# EAGLE design Battery Monitor (EAGLE 5.07)
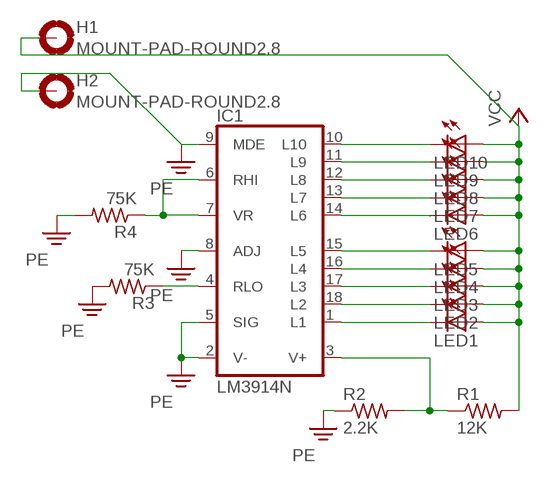
[diagram p0: schematic, sheet 1]

## Parts
H1  MOUNT-PAD-ROUND2.8  [2,8-PAD]
H2  MOUNT-PAD-ROUND2.8  [2,8-PAD]
IC1  LM3914N  [DIL18]
LED1  LEDSMT1206  [1206]
LED2  LEDSMT1206  [1206]
LED3  LEDSMT1206  [1206]
LED4  LEDSMT1206  [1206]
LED5  LEDSMT1206  [1206]
LED6  LEDSMT1206  [1206]
LED7  LEDSMT1206  [1206]
LED8  LEDSMT1206  [1206]
LED9  LEDSMT1206  [1206]
LED10  LEDSMT1206  [1206]
R1  12K  R-US_R0805  [R0805]
R2  2.2K  R-US_R0805  [R0805]
R3  75K  R-US_R0805  [R0805]
R4  75K  R-US_R0805  [R0805]

## Nets
N$1: IC1.3(V+) R1.1 R2.2
N$2: IC1.10(L10) LED10.C
N$3: IC1.11(L9) LED9.C
N$4: IC1.12(L8) LED8.C
N$5: IC1.13(L7) LED7.C
N$7: IC1.14(L6) LED6.C
N$8: IC1.15(L5) LED5.C
N$9: IC1.16(L4) LED4.C
N$10: IC1.17(L3) LED3.C
N$11: IC1.18(L2) LED2.C
N$12: IC1.1(L1) LED1.C
N$14: IC1.4(RLO) R3.1
N$15: IC1.6(RHI) IC1.7(VR) R4.1
PE: H2.B2,8(MOUNT) IC1.2(V-) IC1.5(SIG) IC1.8(ADJ) IC1.9(MDE) R2.1 R3.2 R4.2
VCC: H1.B2,8(MOUNT) LED1.A LED2.A LED3.A LED4.A LED5.A LED6.A LED7.A LED8.A LED9.A LED10.A R1.2

## Library data of the parts
H1 H2 = holes:MOUNT-PAD-ROUND: MOUNTING PAD, round
IC1 = linear:LM3914N: LED DRIVER senses analog voltage levels and drives 10 LEDs
LED1-LED10 = led:LED: LED OSRAM: - CHIPLED LG R971, LG N971, LY N971, LG Q971, LY Q971, LO R971, LY R971 LH N974, LH R974 LS Q976, LO Q976, LY Q976 LO Q996 - Hyper CHIPLED LW Q18S LB Q993, LB Q99A, LB R99A - SideLED LS A670, LO A670, LY A670, LG A670, LP A670 LB A673, LV A673, LT A673, LW A673 LH A674 LY A675 LS A676, LA A676, LO A676, LY A676, LW A676 LS A679, LY A679, LG A679 - Hyper Micro SIDELED® LS Y876, LA Y876, LO Y876, LY Y876 LT Y87S - SmartLED LW L88C, LW L88S LB L89C, LB L89S, LG L890 LS L89K, LO L89K, LY L89K LS L896, LA L896, LO L896, LY L896 - TOPLED LS T670, LO T670, LY T670, LG T670, LP T670 LSG T670, LSP T670, LSY T670, LOP T670, LYG T670 LG T671, LOG T671, LSG T671 LB T673, LV T673, LT T673, LW T673 LH T674 LS T676, LA T676, LO T676, LY T676, LB T676, LH T676, LSB T676, LW T676 LB T67C, LV T67C, LT T67C, LS T67K, LO T67K, LY T67K, LW E67C LS E67B, LA E67B, LO E67B, LY E67B, LB E67C, LV E67C, LT E67C LW T67C LS T679, LY T679, LG T679 LS T770, LO T770, LY T770, LG T770, LP T770 LB T773, LV T773, LT T773, LW T773 LH T774 LS E675, LA E675, LY E675, LS T675 LS T776, LA T776, LO T776, LY T776, LB T776 LHGB T686 LT T68C, LB T68C - Hyper Mini TOPLED® LB M676 - Mini TOPLED Santana® LG M470 LS M47K, LO M47K, LY M47K Source: http://www.osram.convergy.de LUXEON: - LUMILED® LXK2-PW12-R00, LXK2-PW12-S00, LXK2-PW14-U00, LXK2-PW14-V00 LXK2-PM12-R00, LXK2-PM12-S00, LXK2-PM14-U00 LXK2-PE12-Q00, LXK2-PE12-R00, LXK2-PE12-S00, LXK2-PE14-T00, LXK2-PE14-U00 LXK2-PB12-K00, LXK2-PB12-L00, LXK2-PB12-M00, LXK2-PB14-N00, LXK2-PB14-P00, LXK2-PB14-Q00 LXK2-PR12-L00, LXK2-PR12-M00, LXK2-PR14-Q00, LXK2-PR14-R00 LXK2-PD12-Q00, LXK2-PD12-R00, LXK2-PD12-S00 LXK2-PH12-R00, LXK2-PH12-S00 LXK2-PL12-P00, LXK2-PL12-Q00, LXK2-PL12-R00 Source: www.luxeon.com KINGBRIGHT: KA-3528ASYC Source: www.kingbright.com
R1-R4 = resistor:R-US_: RESISTOR, American symbol

## Board
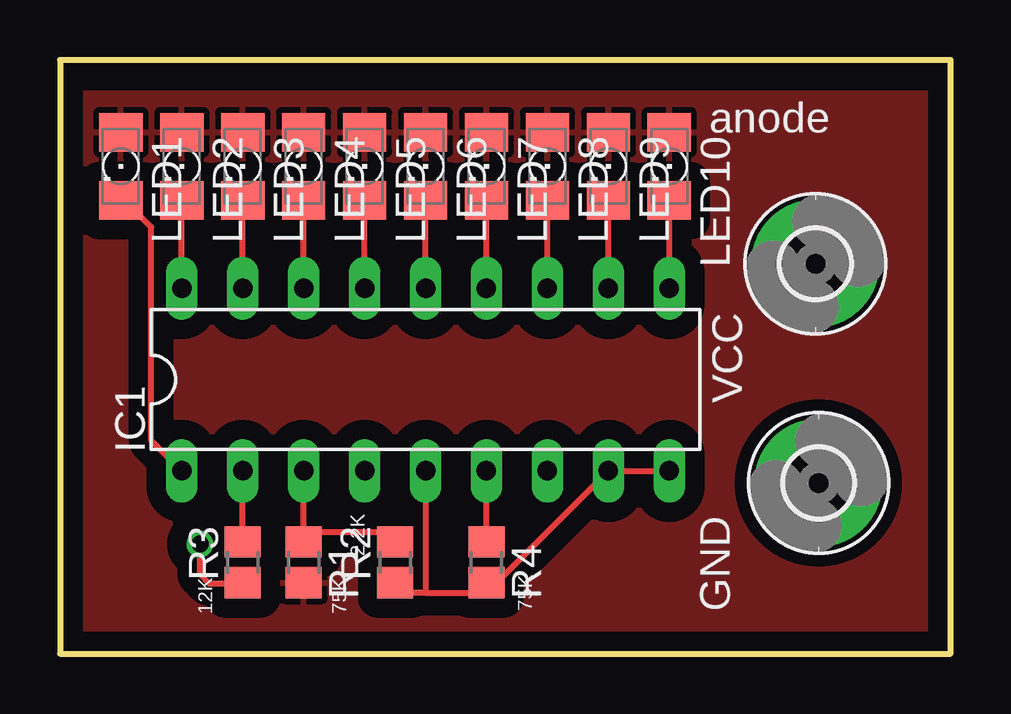
[diagram p1: board, top side]
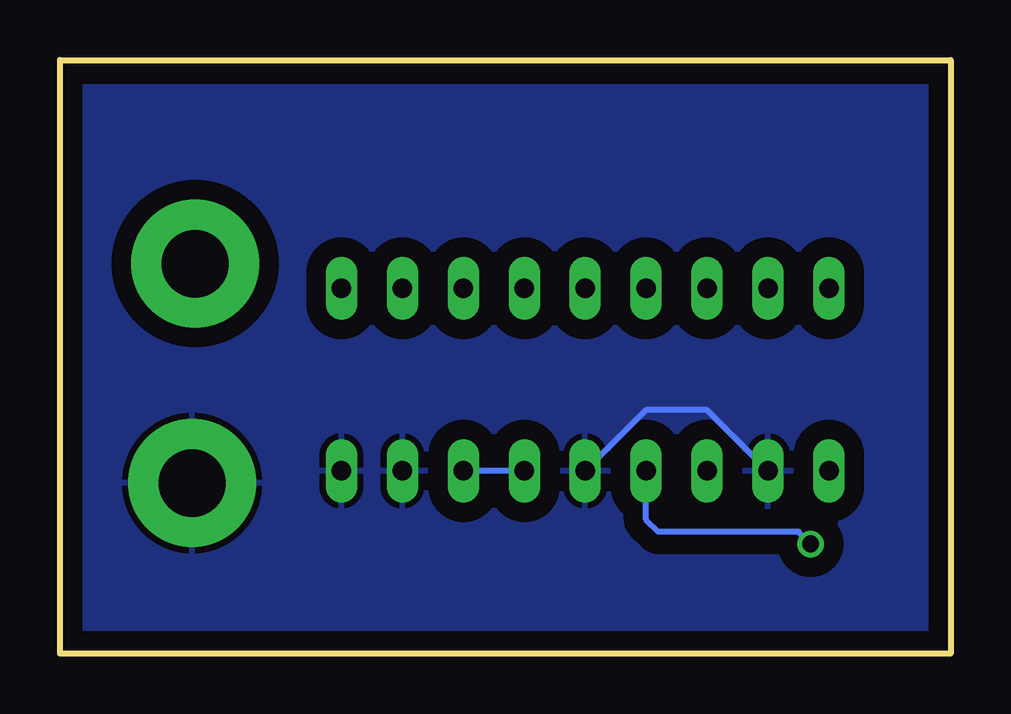
[diagram p2: board, bottom side, seen from below]

Size 37.13 x 24.75 mm. Coordinates in mm from the lower left corner, seen from the top.
Outline: 0,0 37.13,0 37.13,24.75 0,24.75 0,0
Copper layers (1*16): Top 0.0356mm / dielectric 1.5011mm / Bottom 0.0356mm
Design rules "typical_4pcb": minimum track width 10mil, minimum drill 15mil, track to track 6mil, track to pad 6mil, pad to pad 6mil, via to via 6mil, smd to smd 6mil, copper to edge 15mil, drill to drill 8mil, minimum pad ring 10mil, minimum via ring 8mil, stop-mask expansion 4mil, vias tented up to drill 0mil, thermal gap 10mil

### Footprints (pad centres in the part's own frame; a part is rotated, then mirrored left to right if it is on the bottom)
2,8-PAD = drill 2.8 pad 5.334 round: B2,8 0,0
DIL18 = drill 0.813 long: 1 -10.16,-3.81; 2 -7.62,-3.81; 3 -5.08,-3.81; 4 -2.54,-3.81; 5 0,-3.81; 6 2.54,-3.81; 7 5.08,-3.81; 8 7.62,-3.81; 9 10.16,-3.81; 10 10.16,3.81; 11 7.62,3.81; 12 5.08,3.81; 13 2.54,3.81; 14 0,3.81; 15 -2.54,3.81; 16 -5.08,3.81; 17 -7.62,3.81; 18 -10.16,3.81
1206 = smd 1.6 x 1.803: A -1.422,0; C 1.422,0
R0805 = smd 1.3 x 1.5: 1 -0.85,0; 2 0.85,0

### Placement (x,y rotation side)
H1  31.5,16.26 0 top
H2  31.62,7.11 0 top
IC1  15.24,11.43 0 top
LED1  2.54,20.32 270 top
LED2  5.08,20.32 270 top
LED3  7.62,20.32 270 top
LED4  10.16,20.32 270 top
LED5  12.7,20.32 270 top
LED6  15.24,20.32 270 top
LED7  17.78,20.32 270 top
LED8  20.32,20.32 270 top
LED9  22.86,20.32 270 top
LED10  25.4,20.32 270 top
R1  10.16,3.81 270 top
R2  13.97,3.81 90 top
R3  7.62,3.81 90 top
R4  17.78,3.81 270 top

### Tracks (layer width: path | path; a pad name or v marks a point on that pad's centre or on a via)
N$1
  Top 0.254: 10.16,5.08 IC1.3 | 10.16,5.08 13.97,5.08 R2.2 | R1.1 10.16,5.08
N$2
  Top 0.254: IC1.10 LED10.C 25.4,19.05
N$3
  Top 0.254: IC1.11 LED9.C 22.86,19.05
N$4
  Top 0.254: IC1.12 LED8.C 20.32,19.05
N$5
  Top 0.254: IC1.13 LED7.C 17.78,19.05
N$7
  Top 0.254: IC1.14 LED6.C 15.24,19.05
N$8
  Top 0.254: IC1.15 LED5.C 12.7,19.05
N$9
  Top 0.254: IC1.16 LED4.C 10.16,19.05
N$10
  Top 0.254: IC1.17 LED3.C 7.62,19.05
N$11
  Top 0.254: IC1.18 LED2.C 5.08,19.05
N$12
  Top 0.254: IC1.1 3.81,8.89 3.81,17.78 2.54,19.05 LED1.C
N$14  (via drill 0.7)
  Top 0.254: v5.84,4.57 5.84,3.3 6.22,2.92 7.58,2.92 R3.1
  Bottom 0.254: IC1.4 12.7,5.59 12.19,5.08 6.35,5.08 v5.84,4.57
N$15
  Top 0.254: R4.1 IC1.6
  Bottom 0.254: IC1.6 IC1.7
PE
  Top 0.254: IC1.9 IC1.8 17.78,2.54 | R3.2 IC1.2 | 15.24,2.54 17.78,2.54 | 15.24,2.54 13.97,2.54 R2.1 | IC1.5 15.24,2.54 | 17.78,2.54 R4.2
  Bottom 0.254: IC1.2 10.16,10.16 12.7,10.16 IC1.5
  pour Bottom (isolate 0.813): 36.7,0.76 0.38,0.76 0.38,23.62 36.7,23.62
VCC
  pour Top (isolate 0.813): 36.45,0.38 0.89,0.38 0.89,23.37 36.45,23.37

### Text on the board
tPlace: anode | VCC | 2.2K | 75K | GND | 12K | 75K